# EAGLE design FT230X-Breakout-v10 (EAGLE 7.3.0)
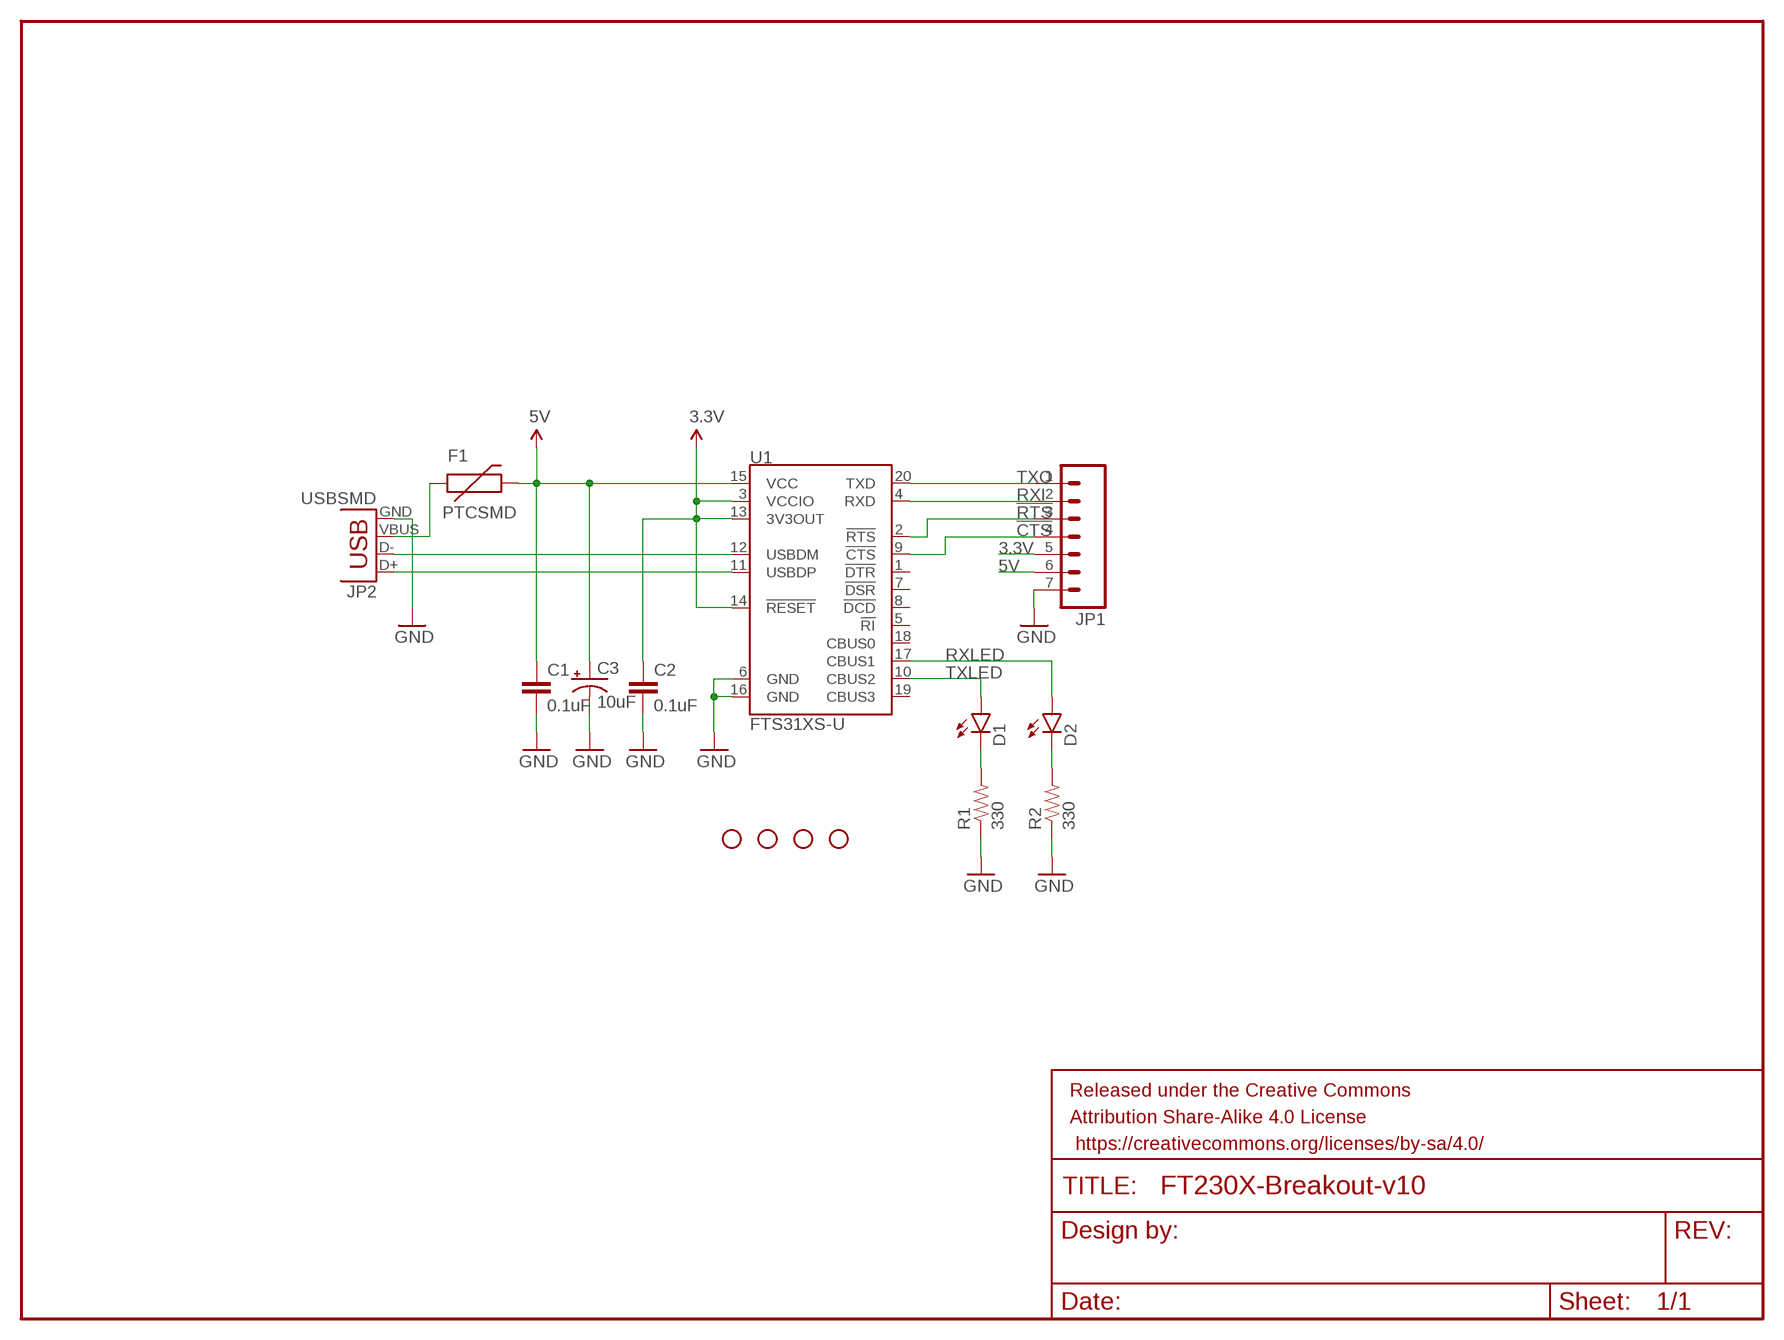
[diagram p0: schematic, sheet 1]

## Parts
C1  0.1uF  CAP0603-CAP  [0603-CAP]
C2  0.1uF  CAP0603-CAP  [0603-CAP]
C3  10uF  CAP_POL1206-KIT  [EIA3216-KIT]
D1  LED0603  [LED-0603]
D2  LED0603  [LED-0603]
F1  PTCSMD  [PTC-1206]
FRAME1  FRAME-LETTER  [CREATIVE_COMMONS]
JP1  M07  [1X07]
JP2  USBSMD  [USB-MINIB]
R1  330  RESISTOR0603-RES  [0603-RES]
R2  330  RESISTOR0603-RES  [0603-RES]
STANDOFF1  STAND-OFF  [STAND-OFF]
STANDOFF2  STAND-OFF  [STAND-OFF]
STANDOFF3  STAND-OFF  [STAND-OFF]
STANDOFF4  STAND-OFF  [STAND-OFF]
U1  FTS31XS-U  FT231XS  [SSOP20_L]

## Nets
3.3V: C2.1 JP1.5 U1.3(VCCIO) U1.13(3V3OUT) U1.14(!RESET)
5V: C1.1 C3.A(+) F1.2 JP1.6 U1.15(VCC)
!CTS: JP1.4 U1.9(!CTS)
!RTS: JP1.3 U1.2(!RTS)
GND: C1.2 C2.2 C3.C(-) JP1.7 JP2.GND R1.1 R2.1 U1.6(GND) U1.16(GND)
N$1: JP2.D- U1.12(USBDM)
N$2: F1.1 JP2.VBUS
N$3: JP2.D+ U1.11(USBDP)
N$4: D1.C R1.2
N$5: D2.C R2.2
RXI: JP1.2 U1.4(RXD)
RXLED: D2.A U1.17(CBUS1)
TXLED: D1.A U1.10(CBUS2)
TXO: JP1.1 U1.20(TXD)
Unconnected: U1.1(!DTR) U1.5(!RI) U1.7(!DSR) U1.8(!DCD) U1.18(CBUS0) U1.19(CBUS3)

## Library data of the parts
C1 C2 = SparkFun-Passives:CAP: Capacitor Standard 0603 ceramic capacitor, and 0.1" leaded capacitor.
C3 = SparkFun-Passives:CAP_POL: Capacitor Polarized These are standard SMD and PTH capacitors. Normally 10uF, 47uF, and 100uF in electrolytic and tantalum varieties. Always verify the external diameter of the through hole cap, it varies with capacity, voltage, and manufacturer. The EIA devices should be standard.
D1 D2 = SparkFun-LED:LED: LEDs Standard schematic elements and footprints for 5mm, 3mm, 1206, and 0603 sized LEDs. 5mm - Spark Fun Electronics SKU : COM-00529 (and others)
F1 = SparkFun-PowerIC:PTC: Resettable Fuse PTC Resettable Fuse. Spark Fun Electronics SKU : COM-08357; PROD_ID: RES-11150
FRAME1 = SparkFun-Aesthetics:FRAME-LETTER: Schematic Frame Standard 8.5x11 US Letter frame
JP1 = SparkFun-Connectors:M07: Header 7 Standard 7-pin 0.1" header. Use with straight break away headers (SKU : PRT-00116), right angle break away headers (PRT-00553), swiss pins (PRT-00743), machine pins (PRT-00117), and female headers (PRT-00115). NOTES ON THE VARIANTS LOCK and LOCK_LONGPADS... This footprint was designed to help hold the alignment of a through-hole component (i.e. 7-pin header) while soldering it into place. You may notice that each hole has been shifted either up or down by 0.005 of an inch from it's more standard position (which is usually a perfectly straight line). This slight alteration caused the pins (the squares in the middle) to touch the edges of the holes. Because they are alternating, it causes a "brace" to hold the header in place. 0.005 has proven to be the perfect amount of "off-center" position when using our standard breakaway headers. Although looks a little odd when you look at the bare footprint, once you have a header in there, the alteration is very hard to notice. Also, if you push a header all the way into place, it is covered up entirely on the bottom side. This idea of altering the position of holes to aid alignment will be further integrated into the Sparkfun Library for other footprints. It can help hold any component with 3 or more connection pins.
JP2 = SparkFun-Connectors:USB: USB Connectors USB-B-PTH is fully proven SKU : PRT-00139/CONN-08278 USB-miniB is fully proven SKU : PRT-00587 USB-A-PCB is untested. USB-A-H is throughly reviewed, but untested. Spark Fun Electronics SKU : PRT-00437 USB-B-SMT is throughly reviewed, but untested. Needs silkscreen touching up. USB-A-S has not been used/tested USB-MB-H has not been used/tested USB-MICROB has been used. CONN-09505; PROD_ID: CONN-08193
R1 R2 = SparkFun-Passives:RESISTOR: Resistor Basic schematic elements and footprints for 0603, 1206, and PTH resistors.
STANDOFF1-STANDOFF4 = SparkFun-Electromechanical:STAND-OFF: #4 Stand Off This is the mechanical footprint for a #4 phillips button head screw. Use the keepout ring to avoid running the screw head into surrounding components. SKU : PRT-00447
U1 = SparkFun-DigitalIC:FT231X: FTDI FT231X Full Speed USB to Full-handshake UART This USB2.0 Full Speed IC offers a compact bridge to full handshake UART interfaces. The device is a UART, capable of operating up to 3MBaud, with low power consumption (8mA). The FT231X includes the complete FT-X series feature set and enables USB to be added into a system design quickly and easily over a UART interface.; PROD_ID: IC-11524

## Board
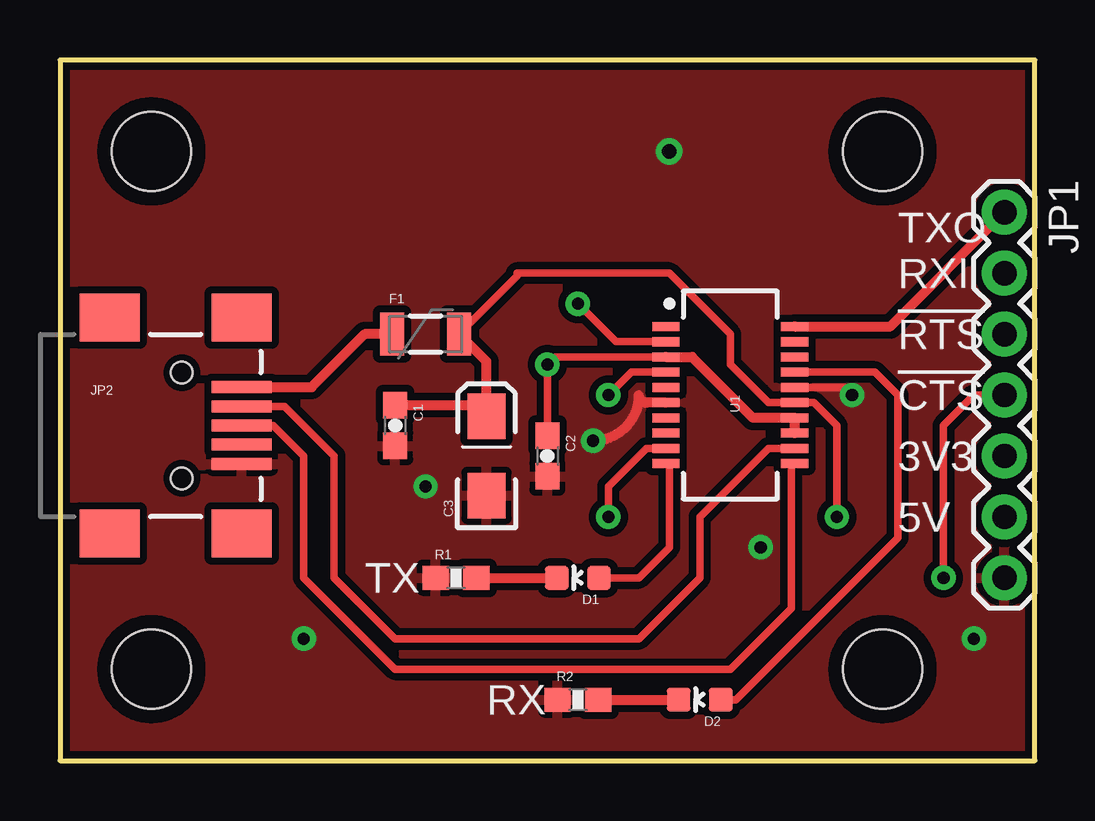
[diagram p1: board, top side]
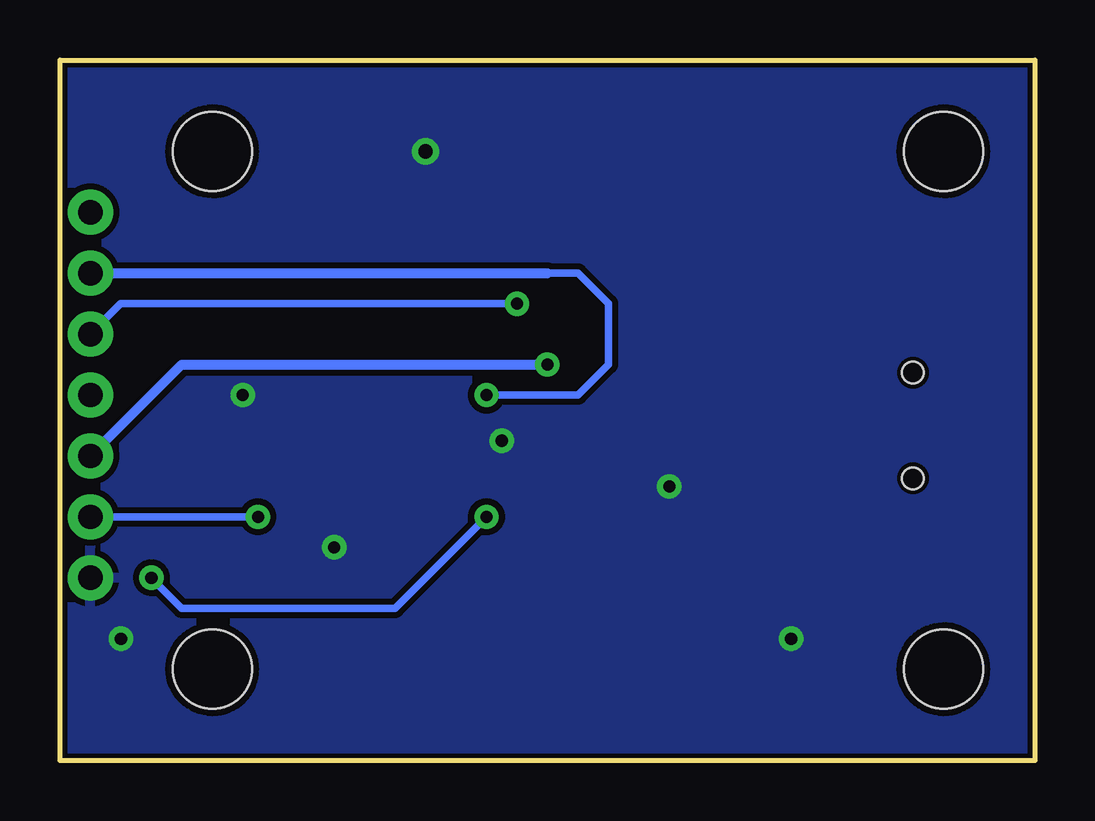
[diagram p2: board, bottom side, seen from below]

Size 40.64 x 29.21 mm. Coordinates in mm from the lower left corner, seen from the top.
Outline: 0,0 40.64,0 40.64,29.21 0,29.2 0,0
Copper layers (1*16): Top 0.035mm / dielectric 1.5mm / Bottom 0.035mm
Design rules "SparkFun-2-layer-STANDARD": minimum track width 10mil, minimum drill 20mil, track to track 10mil, track to pad 8mil, pad to pad 8mil, via to via 10mil, smd to smd 8mil, copper to edge 8mil, drill to drill 8mil, minimum pad ring 10mil, minimum via ring 10mil, stop-mask expansion 4mil, vias tented up to drill 20mil, thermal gap 10mil

### Footprints (pad centres in the part's own frame; a part is rotated, then mirrored left to right if it is on the bottom)
0603-CAP = smd 1.1 x 1: 1 -0.85,0; 2 0.85,0
EIA3216-KIT = smd 1.9 x 1.6: A 1.65,0; C -1.65,0
LED-0603 = smd 1 x 1: A 0,-0.877; C 0,0.877
PTC-1206 = smd 1 x 1.8: 1 -1.4,0; 2 1.4,0
1X07 = drill 1.016 pad 1.88: 1 0,0; 2 2.54,0; 3 5.08,0; 4 7.62,0; 5 10.16,0; 6 12.7,0; 7 15.24,0
USB-MINIB = smd 2.5 x 0.5: D+ 2.5,0; D- 2.5,0.8; GND 2.5,-1.6; ID 2.5,-0.8; VBUS 2.5,1.6 | smd 2.5 x 2: MTN1 -3,4.5; MTN2 2.5,4.5; MTN3 -3,-4.5; MTN4 2.5,-4.5 | hole 0.9: 0,2.2; 0,-2.2
0603-RES = smd 1.1 x 1: 1 -0.85,0; 2 0.85,0
STAND-OFF = hole 3.302: 0,0
SSOP20_L = smd 0.381 x 1.143: 1 -2.857,-2.68; 2 -2.223,-2.68; 3 -1.587,-2.68; 4 -0.953,-2.68; 5 -0.318,-2.68; 6 0.318,-2.68; 7 0.953,-2.68; 8 1.587,-2.68; 9 2.223,-2.68; 10 2.857,-2.68; 11 2.857,2.68; 12 2.223,2.68; 13 1.587,2.68; 14 0.953,2.68; 15 0.318,2.68; 16 -0.318,2.68; 17 -0.953,2.68; 18 -1.587,2.68; 19 -2.223,2.68; 20 -2.857,2.68

### Placement (x,y rotation side)
C1  13.97,13.97 270 top
C2  20.32,12.7 270 top
C3  17.78,12.7 90 top
D1  21.59,7.62 90 top
D2  26.67,2.54 90 top
F1  15.24,17.78 0 top
FRAME1  -1.27,-11.43 0 top  (outside the outline)
JP1  39.37,22.86 270 top
JP2  5.08,13.97 0 top
R1  16.51,7.62 0 top
R2  21.59,2.54 0 top
STANDOFF1  34.29,3.81 0 top
STANDOFF2  34.29,25.4 0 top
STANDOFF3  3.81,25.4 0 top
STANDOFF4  3.81,3.81 0 top
U1  27.94,15.24 270 top

### Tracks (layer width: path | path; a pad name or v marks a point on that pad's centre or on a via)
3.3V  (via drill 0.51)
  Top 0.305: U1.3 20.64,16.83 v20.32,16.51 C2.1
  Top 0.406: U1.13 U1.14 28.89,14.29 26.35,16.83 U1.3
  Bottom 0.406: JP1.5 35.56,16.51 v20.32,16.51
5V  (via drill 0.51)
  Top 0.305: F1.2 19.05,20.19 19.05,20.32 25.4,20.32 27.94,17.78 27.94,16.51 29.53,14.92 U1.15 31.43,14.92 32.38,13.97 v32.38,10.16
  Top 0.406: F1.2 17.78,16.64 C3.A 17.31,14.82 C1.1
  Bottom 0.305: JP1.6 v32.38,10.16
!CTS  (via drill 0.51)
  Top 0.305: JP1.4 38.1,15.24 36.83,13.97 v36.83,7.62 | v22.86,10.16 22.86,11.43 24.45,13.02 U1.9
  Bottom 0.305: v36.83,7.62 35.56,6.35 26.67,6.35 v22.86,10.16
!RTS  (via drill 0.51)
  Top 0.305: v21.59,19.05 23.18,17.46 U1.2
  Bottom 0.305: JP1.3 38.1,19.05 v21.59,19.05
GND  (via drill 0.51, 0.6)
  Top 0.305: v33.02,15.24 32.7,15.56 U1.16
  Top 0.406: U1.6 24.45,14.92 arc-90 24.13,15.24 arc-90 v22.23,13.34
  other vias: 38.1,5.08 15.24,11.43 10.16,5.08 29.21,8.89 25.4,25.4
  pour Top (isolate 0.305): -1.27,30.48 41.91,30.48 41.91,-1.27 -1.27,-1.27
  pour Bottom: -1.27,30.48 41.91,30.48 41.91,24.13 41.91,-1.27 -1.27,-1.27
N$1
  Top 0.305: JP2.D- 9.36,14.77 11.43,12.7 11.43,7.62 13.97,5.08 24.13,5.08 26.67,7.62 26.67,10.16 29.53,13.02 U1.12
N$2
  Top 0.406: JP2.VBUS 10.49,15.57 12.7,17.78 F1.1
N$3
  Top 0.305: JP2.D+ 8.89,13.97 10.16,12.7 10.16,7.62 13.97,3.81 27.94,3.81 30.48,6.35 30.48,12.24 U1.11
N$4
  Top 0.406: R1.2 D1.C
N$5
  Top 0.406: R2.2 D2.C
RXI  (via drill 0.51)
  Top 0.305: U1.4 23.81,16.19 v22.86,15.24
  Bottom 0.305: 20.32,20.32 19.05,20.32 17.78,19.05 17.78,16.51 19.05,15.24 v22.86,15.24
  Bottom 0.406: JP1.2 20.32,20.32
RXLED
  Top 0.305: D2.A 28.18,2.54 34.92,9.28 34.92,15.24 33.97,16.19 U1.17
TXLED
  Top 0.305: D1.A 24.13,7.62 25.4,8.89 25.4,12.24 U1.10
TXO
  Top 0.406: U1.20 34.61,18.1 JP1.1

### Text on the board
tPlace: TXO | RXI | !RTS | !CTS | 3V3 | 5V | TX | RX